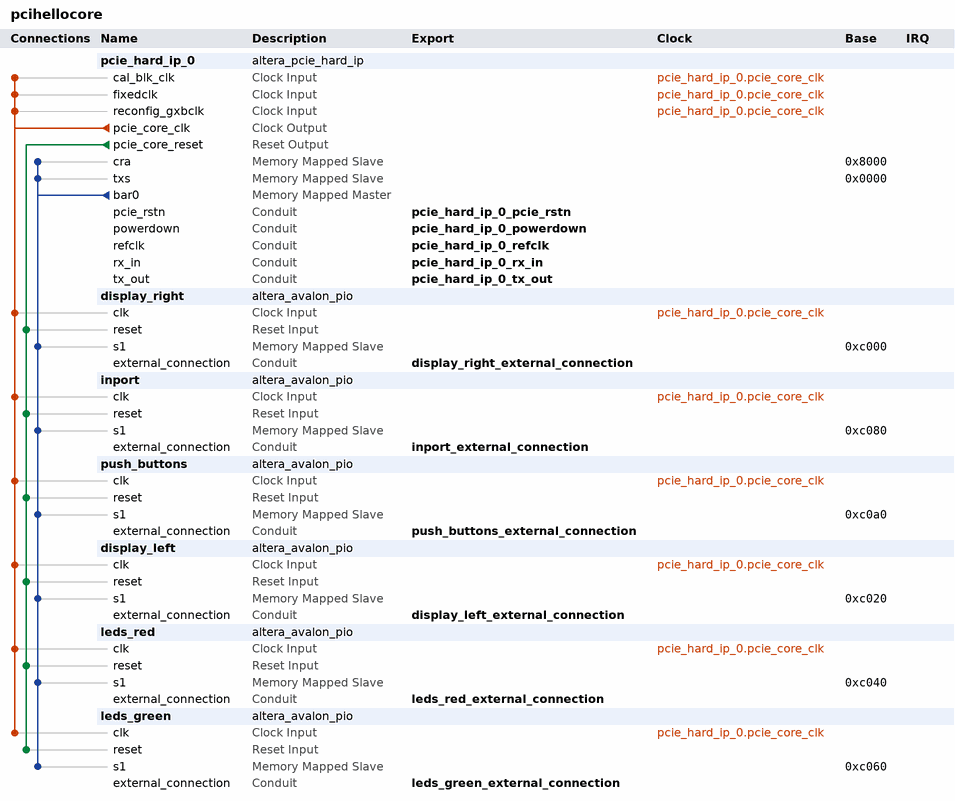
[diagram p0: system contents]
# Platform Designer (Qsys) system pcihellocore, Cyclone IV GX EP4CGX150DF31C7
# Parameters at their usual value, and those the tool derives, are not listed.
package require -exact qsys 17.1
create_system pcihellocore
set_project_property DEVICE_FAMILY {Cyclone IV GX}
set_project_property DEVICE EP4CGX150DF31C7

add_instance pcie_hard_ip_0 altera_pcie_hard_ip 17.1
set_instance_parameter_value pcie_hard_ip_0 {BAR Type} {32 bit Non-Prefetchable,Not used,Not used,Not used,Not used,Not used}
set_instance_parameter_value pcie_hard_ip_0 CB_A2P_ADDR_MAP_PASS_THRU_BITS 15
set_instance_parameter_value pcie_hard_ip_0 CG_ENABLE_A2P_INTERRUPT 0
set_instance_parameter_value pcie_hard_ip_0 CG_NO_CPL_REORDERING 0
set_instance_parameter_value pcie_hard_ip_0 {PCIe Address 31:0} 0x00000000,0x00000000,0x00000000,0x00000000,0x00000000,0x00000000,0x00000000,0x00000000,0x00000000,0x00000000,0x00000000,0x00000000,0x00000000,0x00000000,0x00000000,0x00000000
set_instance_parameter_value pcie_hard_ip_0 {PCIe Address 63:32} 0x00000000,0x00000000,0x00000000,0x00000000,0x00000000,0x00000000,0x00000000,0x00000000,0x00000000,0x00000000,0x00000000,0x00000000,0x00000000,0x00000000,0x00000000,0x00000000
set_instance_parameter_value pcie_hard_ip_0 class_code 0
set_instance_parameter_value pcie_hard_ip_0 device_id 4
set_instance_parameter_value pcie_hard_ip_0 my_advanced_errors false
set_instance_parameter_value pcie_hard_ip_0 my_enable_ecrc_check false
set_instance_parameter_value pcie_hard_ip_0 my_enable_ecrc_gen false
set_instance_parameter_value pcie_hard_ip_0 p_pcie_app_clk 1
set_instance_parameter_value pcie_hard_ip_0 p_pcie_test_out_width None
set_instance_parameter_value pcie_hard_ip_0 p_user_msi_enable 0
set_instance_parameter_value pcie_hard_ip_0 subsystem_device_id 4
set_instance_parameter_value pcie_hard_ip_0 subsystem_vendor_id 4466
set_instance_parameter_value pcie_hard_ip_0 vendor_id 4466

add_instance display_right altera_avalon_pio 17.1
set_instance_parameter_value display_right direction Output
set_instance_parameter_value display_right width 32

add_instance inport altera_avalon_pio 17.1
set_instance_parameter_value inport direction Input
set_instance_parameter_value inport width 16

add_instance push_buttons altera_avalon_pio 17.1
set_instance_parameter_value push_buttons direction Input
set_instance_parameter_value push_buttons width 32

add_instance display_left altera_avalon_pio 17.1
set_instance_parameter_value display_left direction Output
set_instance_parameter_value display_left width 32

add_instance leds_red altera_avalon_pio 17.1
set_instance_parameter_value leds_red direction Output
set_instance_parameter_value leds_red width 32

add_instance leds_green altera_avalon_pio 17.1
set_instance_parameter_value leds_green direction Output
set_instance_parameter_value leds_green width 32

# connections
add_connection pcie_hard_ip_0.pcie_core_clk display_left.clk clock
add_connection pcie_hard_ip_0.pcie_core_clk display_right.clk clock
add_connection pcie_hard_ip_0.pcie_core_clk inport.clk clock
add_connection pcie_hard_ip_0.pcie_core_clk leds_green.clk clock
add_connection pcie_hard_ip_0.pcie_core_clk leds_red.clk clock
add_connection pcie_hard_ip_0.pcie_core_clk pcie_hard_ip_0.cal_blk_clk clock
add_connection pcie_hard_ip_0.pcie_core_clk pcie_hard_ip_0.fixedclk clock
add_connection pcie_hard_ip_0.pcie_core_clk pcie_hard_ip_0.reconfig_gxbclk clock
add_connection pcie_hard_ip_0.pcie_core_clk push_buttons.clk clock
add_connection pcie_hard_ip_0.pcie_core_reset display_left.reset reset
add_connection pcie_hard_ip_0.pcie_core_reset display_right.reset reset
add_connection pcie_hard_ip_0.pcie_core_reset inport.reset reset
add_connection pcie_hard_ip_0.pcie_core_reset leds_green.reset reset
add_connection pcie_hard_ip_0.pcie_core_reset leds_red.reset reset
add_connection pcie_hard_ip_0.pcie_core_reset push_buttons.reset reset
add_connection pcie_hard_ip_0.bar0 display_left.s1 avalon
set_connection_parameter_value pcie_hard_ip_0.bar0/display_left.s1 baseAddress 0xc020
add_connection pcie_hard_ip_0.bar0 display_right.s1 avalon
set_connection_parameter_value pcie_hard_ip_0.bar0/display_right.s1 baseAddress 0xc000
add_connection pcie_hard_ip_0.bar0 inport.s1 avalon
set_connection_parameter_value pcie_hard_ip_0.bar0/inport.s1 baseAddress 0xc080
add_connection pcie_hard_ip_0.bar0 leds_green.s1 avalon
set_connection_parameter_value pcie_hard_ip_0.bar0/leds_green.s1 baseAddress 0xc060
add_connection pcie_hard_ip_0.bar0 leds_red.s1 avalon
set_connection_parameter_value pcie_hard_ip_0.bar0/leds_red.s1 baseAddress 0xc040
add_connection pcie_hard_ip_0.bar0 pcie_hard_ip_0.cra avalon
set_connection_parameter_value pcie_hard_ip_0.bar0/pcie_hard_ip_0.cra baseAddress 0x8000
add_connection pcie_hard_ip_0.bar0 pcie_hard_ip_0.txs avalon
set_connection_parameter_value pcie_hard_ip_0.bar0/pcie_hard_ip_0.txs baseAddress 0x0000
add_connection pcie_hard_ip_0.bar0 push_buttons.s1 avalon
set_connection_parameter_value pcie_hard_ip_0.bar0/push_buttons.s1 baseAddress 0xc0a0

# exported interfaces
add_interface display_left_external_connection conduit end
set_interface_property display_left_external_connection EXPORT_OF display_left.external_connection
add_interface display_right_external_connection conduit end
set_interface_property display_right_external_connection EXPORT_OF display_right.external_connection
add_interface inport_external_connection conduit end
set_interface_property inport_external_connection EXPORT_OF inport.external_connection
add_interface leds_green_external_connection conduit end
set_interface_property leds_green_external_connection EXPORT_OF leds_green.external_connection
add_interface leds_red_external_connection conduit end
set_interface_property leds_red_external_connection EXPORT_OF leds_red.external_connection
add_interface pcie_hard_ip_0_pcie_rstn conduit end
set_interface_property pcie_hard_ip_0_pcie_rstn EXPORT_OF pcie_hard_ip_0.pcie_rstn
add_interface pcie_hard_ip_0_powerdown conduit end
set_interface_property pcie_hard_ip_0_powerdown EXPORT_OF pcie_hard_ip_0.powerdown
add_interface pcie_hard_ip_0_refclk conduit end
set_interface_property pcie_hard_ip_0_refclk EXPORT_OF pcie_hard_ip_0.refclk
add_interface pcie_hard_ip_0_rx_in conduit end
set_interface_property pcie_hard_ip_0_rx_in EXPORT_OF pcie_hard_ip_0.rx_in
add_interface pcie_hard_ip_0_tx_out conduit end
set_interface_property pcie_hard_ip_0_tx_out EXPORT_OF pcie_hard_ip_0.tx_out
add_interface push_buttons_external_connection conduit end
set_interface_property push_buttons_external_connection EXPORT_OF push_buttons.external_connection

set_interconnect_requirement {$system} qsys_mm.clockCrossingAdapter HANDSHAKE
set_interconnect_requirement {$system} qsys_mm.maxAdditionalLatency 1

save_system pcihellocore.qsys
